# EAGLE design 3K_valdiklis_v1 (EAGLE 6.4)
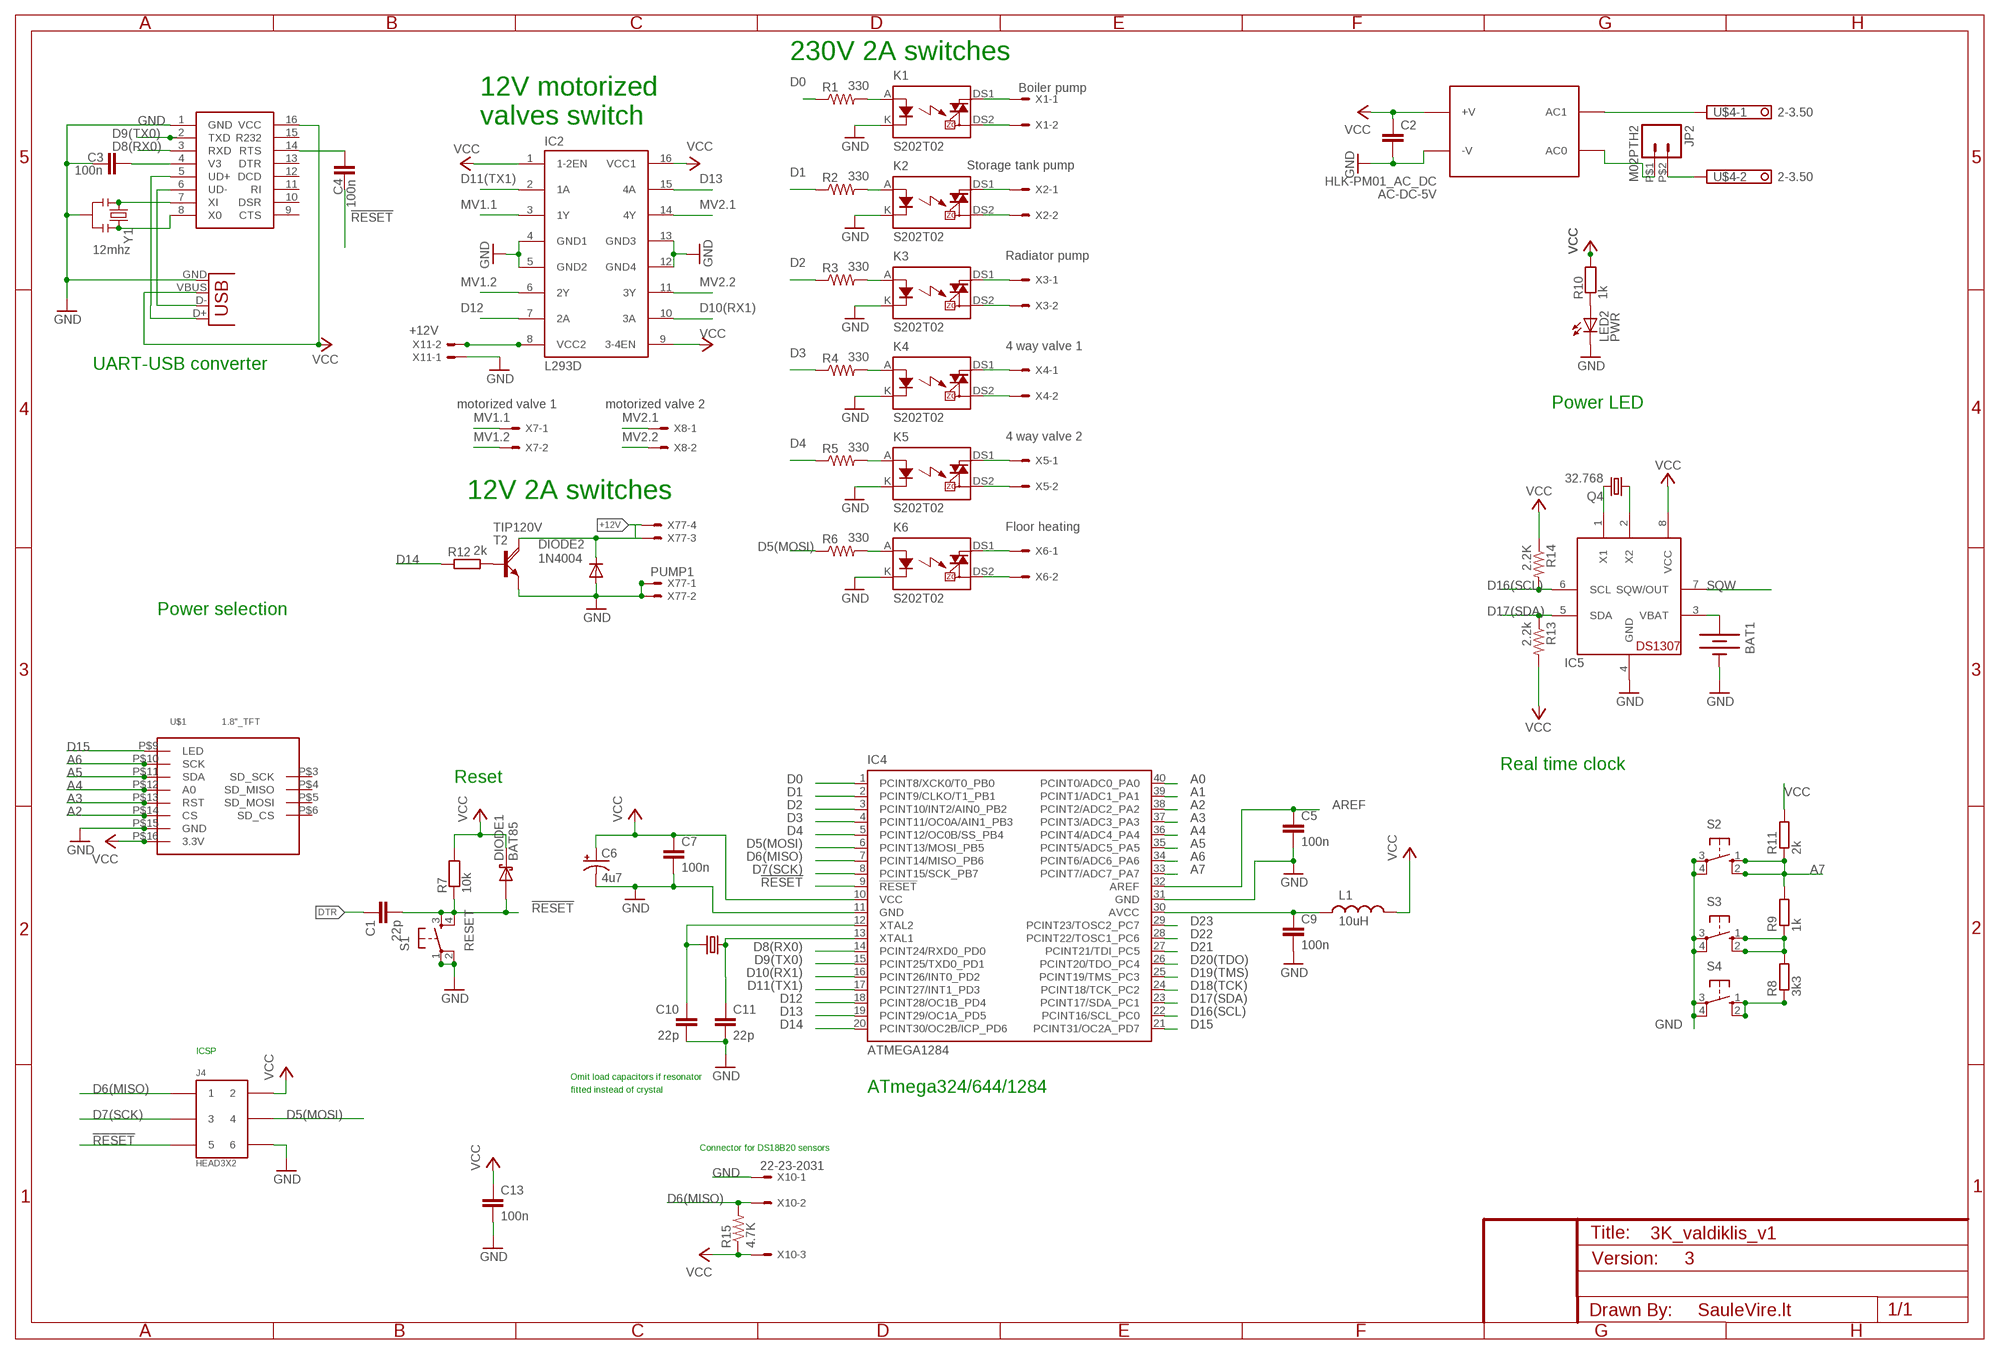
[diagram p0: schematic, sheet 1]

## Parts
AC-DC-5V  HLK-PM01_AC_DC  [HLK-PM01_AC_DC]
BAT1  BATTERY20PTH  [BATTCOM_20MM_PTH]
C1  22p  CAPPTH  [CAP-PTH-SMALL]
C2  C-EU025-024X044  [C025-024X044]
C3  100n  CAPPTH  [CAP-PTH-SMALL]
C4  100n  CAPPTH  [CAP-PTH-SMALL]
C5  100n  CAPPTH  [CAP-PTH-SMALL]
C6  4u7  CAP_POLPTH2  [CPOL-RADIAL-10UF-25V]
C7  100n  CAPPTH  [CAP-PTH-SMALL]
C9  100n  CAPPTH  [CAP-PTH-SMALL]
C10  22p  CAPPTH  [CAP-PTH-SMALL]
C11  22p  CAPPTH  [CAP-PTH-SMALL]
C13  100n  CAPPTH  [CAP-PTH-SMALL]
DIODE1  BAT85  DIODE-SCHOTTKY  [DIODE-TH-0.4]
DIODE2  1N4004  [DO41-10]
IC2  L293D  [DIL16]
IC4  ATMEGA1284  ATMEGA644-20PU  [DIL40]
IC5  DS1307  [DIL08]
J4  HEAD3X2  [HEAD3X2]
JP2  M02PTH2  [1X02_BIG]
JP3  USB-B  USBPTH  [USB-B-PTH]
K1  S202T02  [S202T02]
K2  S202T02  [S202T02]
K3  S202T02  [S202T02]
K4  S202T02  [S202T02]
K5  S202T02  [S202T02]
K6  S202T02  [S202T02]
L1  10uH  INDUCTOR0.4"-AXIAL  [RES-AXIAL-0.4]
LED2  PWR  LED3MM  [LED3MM]
Q4  32.768  CRYTALTC38H  [TC38H]
R1  330  R-US_0207/10  [0207/10]
R2  330  R-US_0207/10  [0207/10]
R3  330  R-US_0207/10  [0207/10]
R4  330  R-US_0207/10  [0207/10]
R5  330  R-US_0207/10  [0207/10]
R6  330  R-US_0207/10  [0207/10]
R7  10k  RESISTOR  [RES-AXIAL-0.4]
R8  3k3  R-EU_0207/10  [0207/10]
R9  1k  R-EU_0207/10  [0207/10]
R10  1k  RESISTOR  [RES-AXIAL-0.4]
R11  2k  R-EU_0207/10  [0207/10]
R12  2k  R-EU_0207/10  [0207/10]
R13  2.2k  R-US_0207/10  [0207/10]
R14  2.2K  R-US_0207/10  [0207/10]
R15  4.7K  R-US_0207/10  [0207/10]
S1  RESET  TAC_SWITCHPTH  [TACTILE-PTH]
S2  10-XX  [B3F-10XX]
S3  10-XX  [B3F-10XX]
S4  10-XX  [B3F-10XX]
T2  TIP120V  [TO220AV]
U$1  1.8"_TFT  [1.8"_TFT]
U$2  CH340G  [SO016]
U$4  2-3.50  [2-3.50]
X1  Boiler pump  22-23-2021  [22-23-2021]
X2  Storage tank pump  22-23-2021  [22-23-2021]
X3  Radiator pump  22-23-2021  [22-23-2021]
X4  4 way valve 1  22-23-2021  [22-23-2021]
X5  4 way valve 2  22-23-2021  [22-23-2021]
X6  Floor heating  22-23-2021  [22-23-2021]
X7  motorized valve 1  22-23-2021  [22-23-2021]
X8  motorized valve 2  22-23-2021  [22-23-2021]
X9  16MHz  CRYSTALHC49US  [HC49US]
X10  22-23-2031  [22-23-2031]
X11  +12V  22-23-2021  [22-23-2021]
X77  PUMP1  22-23-2041  [22-23-2041]
Y1  12mhz  RESONATORPTH  [RESONATOR-PTH]

## Nets
220V [220v]: AC-DC-5V.AC1 U$4.1
!RESET: C1.2 C4.1 DIODE1.A IC4.9(!RESET) J4.5 R7.P$1 S1.3 S1.4
+12V: DIODE2.C T2.C X77.3 X77.4
A0: IC4.40(PCINT0/ADC0_PA0)
A1: IC4.39(PCINT1/ADC1_PA1)
A2: IC4.38(PCINT2/ADC2_PA2) U$1.P$14(CS)
A3: IC4.37(PCINT3/ADC3_PA3) U$1.P$13(RST)
A4: IC4.36(PCINT4/ADC4_PA4) U$1.P$12(A0)
A5: IC4.35(PCINT5/ADC5_PA5) U$1.P$11(SDA)
A6: IC4.34(PCINT6/ADC6_PA6) U$1.P$10(SCK)
A7: IC4.33(PCINT7/ADC7_PA7) R9.2 R11.1 S2.1(S) S2.2(S1)
AREF: C5.1 IC4.32(AREF)
AVCC [vcc]: C9.1 IC4.30(AVCC) L1.P$1
D0: IC4.1(PCINT8/XCK0/T0_PB0) R1.1
D1: IC4.2(PCINT9/CLKO/T1_PB1) R2.1
D2: IC4.3(PCINT10/INT2/AIN0_PB2) R3.1
D3: IC4.4(PCINT11/OC0A/AIN1_PB3) R4.1
D4: IC4.5(PCINT12/OC0B/SS_PB4) R5.1
D5(MOSI): IC4.6(PCINT13/MOSI_PB5) J4.4 R6.1
D6(MISO): IC4.7(PCINT14/MISO_PB6) J4.1 R15.2 X10.2
D7(SCK): IC4.8(PCINT15/SCK_PB7) J4.3
D8(RX0): IC4.14(PCINT24/RXD0_PD0) U$2.3(RXD)
D9(TX0): IC4.15(PCINT25/TXD0_PD1) U$2.2(TXD)
D10(RX1): IC2.10(3A) IC4.16(PCINT26/INT0_PD2)
D11(TX1): IC2.2(1A) IC4.17(PCINT27/INT1_PD3)
D12: IC2.7(2A) IC4.18(PCINT28/OC1B_PD4)
D13: IC2.15(4A) IC4.19(PCINT29/OC1A_PD5)
D14: IC4.20(PCINT30/OC2B/ICP_PD6) R12.1
D15: IC4.21(PCINT31/OC2A_PD7) U$1.P$9(LED)
D16(SCL): IC4.22(PCINT16/SCL_PC0) IC5.6(SCL) R14.2
D17(SDA): IC4.23(PCINT17/SDA_PC1) IC5.5(SDA) R13.1
D18(TCK): IC4.24(PCINT18/TCK_PC2)
D19(TMS): IC4.25(PCINT19/TMS_PC3)
D20(TDO): IC4.26(PCINT20/TDO_PC4)
D21: IC4.27(PCINT21/TDI_PC5)
D22: IC4.28(PCINT22/TOSC1_PC6)
D23: IC4.29(PCINT23/TOSC2_PC7)
DTR: C1.1
GND [vcc]: AC-DC-5V.-V BAT1.2(-) C2.2 C3.1 C5.2 C6.2(-) C7.2 C9.2 C10.2 C11.2 C13.2 DIODE2.A IC2.4(GND1) IC2.5(GND2) IC2.12(GND4) IC2.13(GND3) IC4.11(GND) IC4.31(GND) IC5.4(GND) J4.6 JP3.GND K1.K K2.K K3.K K4.K K5.K K6.K LED2.K(C) S1.1 S1.2 S2.3(P) S2.4(P1) S3.3(P) S3.4(P1) S4.3(P) S4.4(P1) T2.E U$1.P$15(GND) U$2.1(GND) X10.1 X11.1 X77.1 X77.2 Y1.2
MV1.1: IC2.3(1Y) X7.1
MV1.2: IC2.6(2Y) X7.2
MV2.1: IC2.14(4Y) X8.1
MV2.2: IC2.11(3Y) X8.2
N$1: C11.1 IC4.13(XTAL1) X9.1
N$2: C10.1 IC4.12(XTAL2) X9.2
N$3 [220v]: AC-DC-5V.AC0 JP2.P$1
N$4 [220v]: JP2.P$2 U$4.2
N$6: R8.1 S4.1(S) S4.2(S1)
N$7: U$2.7(XI) Y1.1
N$8: LED2.A R10.P$1
N$9: U$2.8(X0) Y1.3
N$10: R8.2 R9.1 S3.1(S) S3.2(S1)
N$11: C4.2 U$2.14(RTS)
N$12: JP3.D- U$2.6(UD-)
N$13: R12.2 T2.B
N$14: C3.2 U$2.4(V3)
N$16: K3.A R3.2
N$18 [220v]: K3.DS1 X3.1
N$19: IC2.8(VCC2) X11.2
N$20: IC5.1(X1) Q4.2
N$21: IC5.2(X2) Q4.1
N$22: JP3.D+ U$2.5(UD+)
N$23 [220v]: K3.DS2 X3.2
N$24: K2.A R2.2
N$25 [220v]: K2.DS1 X2.1
N$26 [220v]: K2.DS2 X2.2
N$27: BAT1.1(+) IC5.3(VBAT)
N$28: K4.A R4.2
N$29 [220v]: K4.DS1 X4.1
N$30 [220v]: K4.DS2 X4.2
N$31: K1.A R1.2
N$32 [220v]: K1.DS1 X1.1
N$33 [220v]: K1.DS2 X1.2
N$34: K6.A R6.2
N$35 [220v]: K6.DS1 X6.1
N$36 [220v]: K6.DS2 X6.2
N$37: K5.A R5.2
N$38 [220v]: K5.DS1 X5.1
N$39 [220v]: K5.DS2 X5.2
SQW: IC5.7(SQW/OUT)
VCC [vcc]: AC-DC-5V.+V C2.1 C6.1(+) C7.1 C13.1 DIODE1.C IC2.1(1-2EN) IC2.9(3-4EN) IC2.16(VCC1) IC4.10(VCC) IC5.8(VCC) J4.2 JP3.VBUS L1.P$2 R7.P$2 R10.P$2 R11.2 R13.2 R14.1 R15.1 U$1.P$16(3.3V) U$2.16(VCC) X10.3
Unconnected: U$1.P$3(SD_SCK) U$1.P$4(SD_MISO) U$1.P$5(SD_MOSI) U$1.P$6(SD_CS) U$2.9(CTS) U$2.10(DSR) U$2.11(RI) U$2.12(DCD) U$2.13(DTR) U$2.15(R232)

## Notes on the sheet
- 230V 2A switches
- 12V motorized 
  valves switch
- UART-USB converter
- Power LED
- 12V 2A switches
- Power selection
- Real time clock
- Reset
- ICSP
- Omit load capacitors if resonator
- fitted instead of crystal | ATmega324/644/1284
- Connector for DS18B20 sensors
- 3
- SauleVire.lt

## Library data of the parts
AC-DC-5V = HLK-PM01:HLK-PM01_AC_DC: Ultra-compact power module HLK-PM01, http://www.hlktech.net AC-DC 220V to 5V Step Down Power Supply Module Device model created 2016-01-23 by Alvydas. http://www.saulevire.lt
BAT1 = SparkFun-Electromechanical:BATTERY: Battery Holders Various common sizes : AA, AAA, 20mm coin cell and 12mm coin cell. 20MM_4LEGS, BATT-10373
C1 C10 C11 = SparkFun:CAP: Capacitor Standard 0603 ceramic capacitor, and 0.1" leaded capacitor.; OPTION: Do not fit for ceramic resonator
C2 = rcl-1:C-EU: CAPACITOR, European symbol
C3-C5 C7 C9 C13 = SparkFun:CAP: Capacitor Standard 0603 ceramic capacitor, and 0.1" leaded capacitor.
C6 = SparkFun:CAP_POL: Capacitor Polarized These are standard SMD and PTH capacitors. Normally 10uF, 47uF, and 100uF in electrolytic and tantalum varieties. Always verify the external diameter of the through hole cap, it varies with capacity, voltage, and manufacturer. The EIA devices should be standard.
DIODE1 = SteveMarple:DIODE-SCHOTTKY
DIODE2 = diode:1N4004: DIODE general purpose rectifier, 1 A
IC2 = st-microelectronics:L293D: PUSH-PULL 4 CHANNEL DRIVER; MPN: L293D; OC_FARNELL: 9589619; OC_NEWARK: 56P8249
IC4 = SteveMarple:ATMEGA644-*PU: 8-bit Microcontroller with 64K Bytes In-System Programmable Flash Auto generated by make-symbol-device-package-bsdl.ulp Rev. 34 Source: http://www.atmel.com/dyn/resources/prod_documents/doc2593.pdf; MPN: ATMEGA644-20PU; OC_FARNELL: 1288340; OC_NEWARK: 23M5060
IC5 = adafruit:DS1307: DS1307 Real time clock (RTC) with battery backup ability. Talk to it via i2c
J4 = MyCON2:HEAD3X2
JP2 = SparkFun-Connectors-1:M02: Standard 2-pin 0.1" header. Use with - straight break away headers ( PRT-00116) - right angle break away headers (PRT-00553) - swiss pins (PRT-00743) - machine pins (PRT-00117) - female headers (PRT-00115) Molex polarized connector foot print use with: PRT-08233 with associated crimp pins and housings. 2.54_SCREWTERM for use with PRT-10571. 3.5mm Screw Terminal footprints for PRT-08084 5mm Screw Terminal footprints for use with PRT-08433
JP3 = SparkFun-Connectors-1:USB: USB Connectors USB-B-PTH is fully proven SKU : PRT-00139/CONN-08278 USB-miniB is fully proven SKU : PRT-00587 USB-A-PCB is untested. USB-A-H is throughly reviewed, but untested. Spark Fun Electronics SKU : PRT-00437 USB-B-SMT is throughly reviewed, but untested. Needs silkscreen touching up. USB-A-S has not been used/tested USB-MB-H has not been used/tested USB-MICROB has been used. CONN-09505; PROD_ID: CONN-08278
K1-K6 = relay-1:S202T02
L1 = SteveMarple:INDUCTOR: Inductors Basic Inductor/Choke - 0603 and 1206. Footprints are not proven and vary greatly between part numbers.
LED2 = SparkFun:LED: LEDs Standard schematic elements and footprints for 5mm, 3mm, 1206, and 0603 sized LEDs. 5mm - Spark Fun Electronics SKU : COM-00529 (and others)
Q4 = crystal:CRYTAL: CRYSTAL
R1-R6 = resistor-1:R-US_: RESISTOR, American symbol
R7 R10 = SteveMarple:RESISTOR: 1/4W PTH resistor
R8 R9 R11 R12 = resistor:R-EU_: RESISTOR, European symbol
R13-R15 = adafruit:R-US_: RESISTOR, American symbol
S1 = SparkFun:TAC_SWITCH: Momentary Switch Button commonly used for reset or general input. Spark Fun Electronics SKU : COM-00097
S2-S4 = switch-omron:10-XX: OMRON SWITCH; MPN: B3F-1000; OC_FARNELL: 176432; OC_NEWARK: 36M3542
T2 = rocketfarm:TIP120: NPN DARLINGTON TRANSISTOR
U$1 = tft_1.8_1.44_oled_0.96:1.8"_TFT
U$2 = ch340:CH340G: CH340G
U$4 = con-phoenix-350-1:2-3.50
X1-X8 X11 = con-molex:22-23-2021: .100" (2.54mm) Center Header - 2 Pin; MF: MOLEX; MPN: 22-23-2021; OC_FARNELL: 1462926; OC_NEWARK: 25C3832
X9 = SparkFun:CRYSTAL: Crystals Various standard crystals. Proven footprints. Spark Fun Electronics SKU : COM-00534
X10 = con-molex:22-23-2031: .100" (2.54mm) Center Header - 3 Pin; MF: MOLEX; MPN: 22-23-2031; OC_FARNELL: 1462950; OC_NEWARK: 30C0862
X77 = con-molex:22-23-2041: .100" (2.54mm) Center Header - 4 Pin; MF: MOLEX; MPN: 22-23-2041; OC_FARNELL: 1462920; OC_NEWARK: 38C0355
Y1 = SparkFun-FreqCtrl:RESONATOR: Resonator Small SMD resonator. Used, eg, on the Arduino Pro/ Pro Mini boards. 8MHz- XTAL-08895 16MHz- XTAL-08900

## Net classes
1 vcc: width 0.5 mm
4 gnd: width 0.5 mm
5 220v: width 0.5 mm

## Board
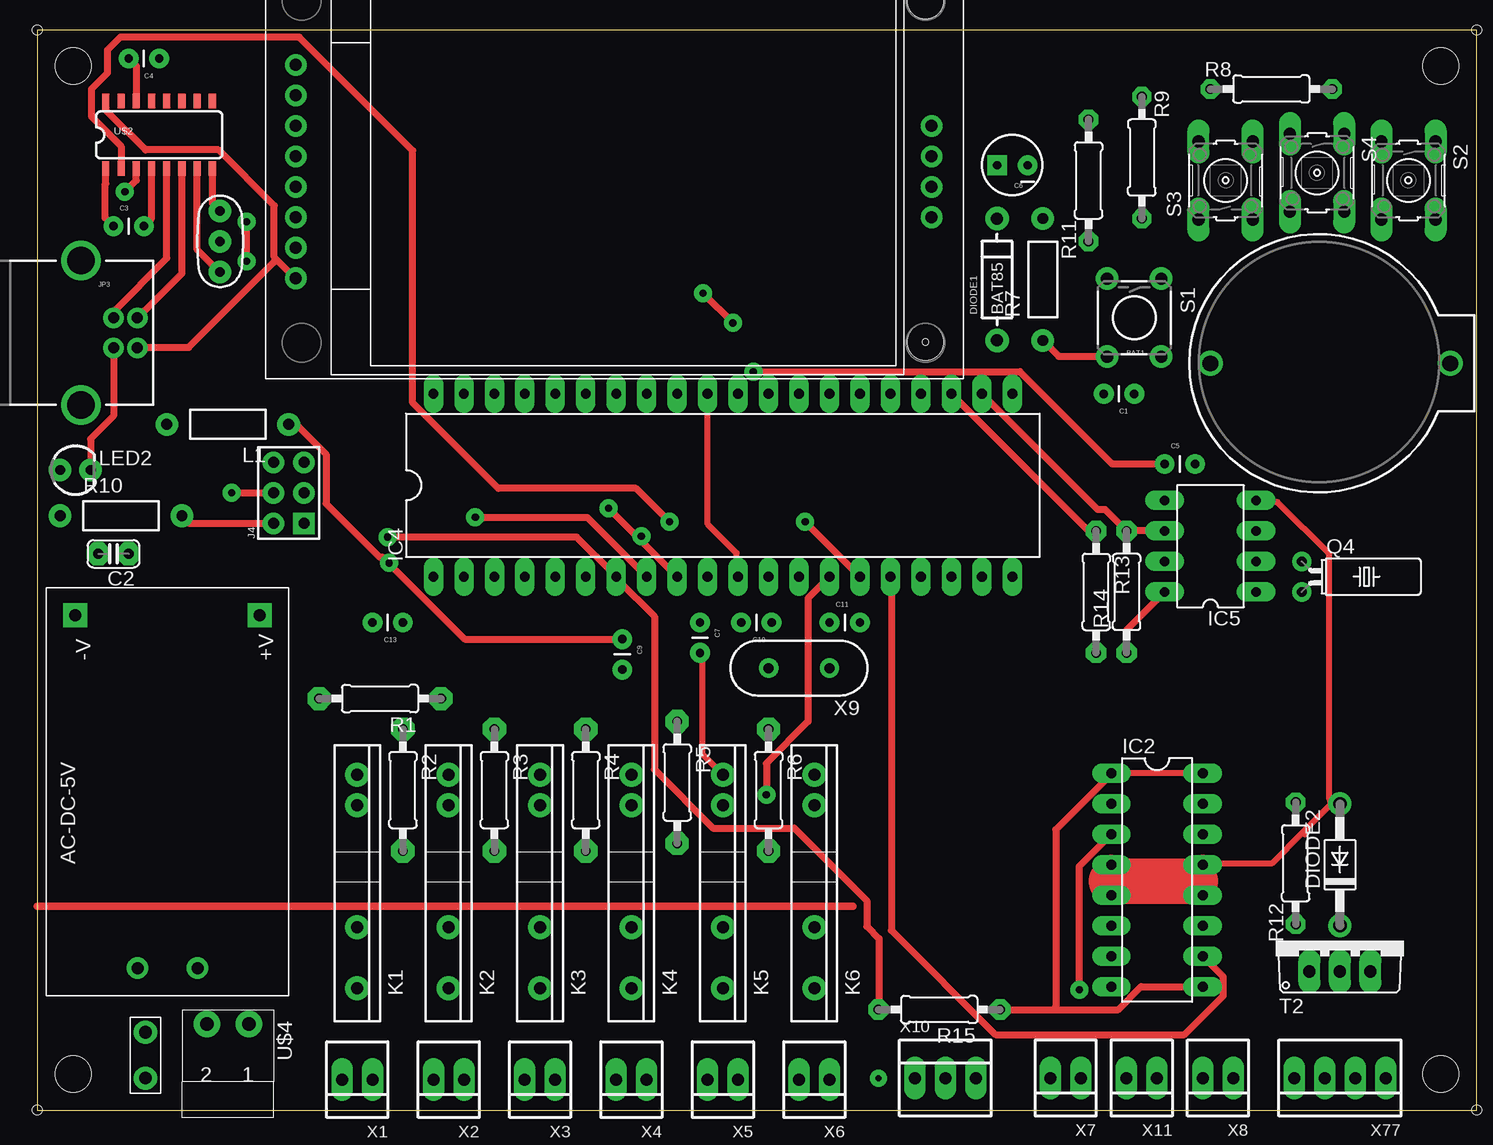
[diagram p1: board, top side]
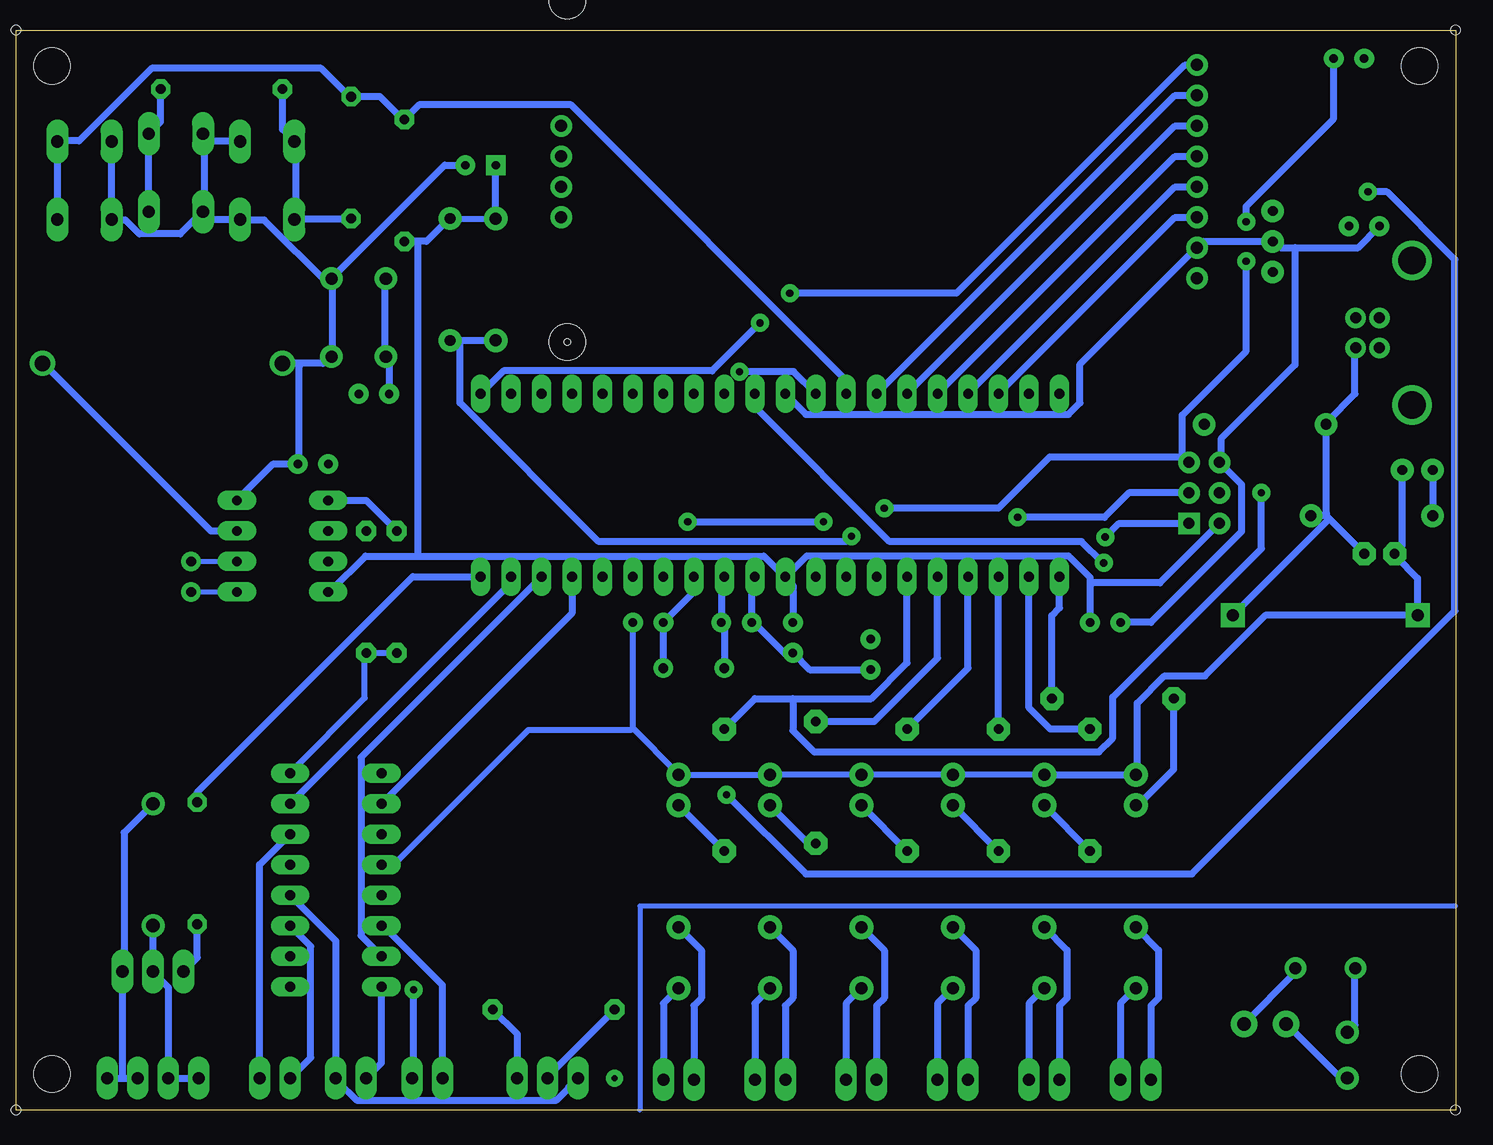
[diagram p2: board, bottom side, seen from below]

No outline drawn. Coordinates in mm, seen from the top.
Copper layers (1*16): Top 0.035mm / dielectric 1.5mm / Bottom 0.035mm
Design rules "3K_valdiklis_v1 *": minimum track width 0.6mm, minimum drill 0.6mm, track to track 0.6mm, track to pad 0.6mm, pad to pad 0.6mm, via to via 0.6mm, smd to smd 0.6mm, copper to edge 0.6mm, drill to drill 0.6mm, minimum pad ring 0.4mm, minimum via ring 0.45mm, stop-mask expansion 0.6mm, vias tented up to drill 0.6mm, thermal gap 0.6mm
Holes 0.51 mm at 74.04,64.01
Holes 3 mm at 74.04,64.01 74.04,92.46 3,87 117,87 3,3 117,3
Holes 0.8 mm at 0,0 0,90 120,90 120,0
Milling: 4 lines

### Footprints (pad centres in the part's own frame; a part is rotated, then mirrored left to right if it is on the bottom)
HLK-PM01_AC_DC = drill 1 pad 2 square: +V 31.7,2.4; -V 31.7,17.8 | drill 1: AC0 2.3,12.6; AC1 2.3,7.6
BATTCOM_20MM_PTH = drill 1.3: 1 20,0; 2 0,0
CAP-PTH-SMALL = drill 0.7 pad 1.651: 1 0,0; 2 2.54,0
C025-024X044 = drill 0.813 pad 1.93 octagon: 1 -1.27,0; 2 1.27,0
CPOL-RADIAL-10UF-25V = drill 0.7 pad 1.651 square: 1 1.27,0 | drill 0.7 pad 1.651: 2 -1.27,0
DIODE-TH-0.4 = drill 1 pad 1.981: A -5.08,0; C 5.08,0
DO41-10 = drill 1.118: A 5.08,0; C -5.08,0
DIL16 = drill 0.813 long: 1 -8.89,-3.81; 2 -6.35,-3.81; 3 -3.81,-3.81; 4 -1.27,-3.81; 5 1.27,-3.81; 6 3.81,-3.81; 7 6.35,-3.81; 8 8.89,-3.81; 9 8.89,3.81; 10 6.35,3.81; 11 3.81,3.81; 12 1.27,3.81; 13 -1.27,3.81; 14 -3.81,3.81; 15 -6.35,3.81; 16 -8.89,3.81
DIL40 = drill 0.813 long: 1 -24.13,-7.62; 2 -21.59,-7.62; 3 -19.05,-7.62; 4 -16.51,-7.62; 5 -13.97,-7.62; 6 -11.43,-7.62; 7 -8.89,-7.62; 8 -6.35,-7.62; 9 -3.81,-7.62; 10 -1.27,-7.62; 11 1.27,-7.62; 12 3.81,-7.62; 13 6.35,-7.62; 14 8.89,-7.62; 15 11.43,-7.62; 16 13.97,-7.62; 17 16.51,-7.62; 18 19.05,-7.62; 19 21.59,-7.62; 20 24.13,-7.62; 21 24.13,7.62; 22 21.59,7.62; 23 19.05,7.62; 24 16.51,7.62; 25 13.97,7.62; 26 11.43,7.62; 27 8.89,7.62; 28 6.35,7.62; 29 3.81,7.62; 30 1.27,7.62; 31 -1.27,7.62; 32 -3.81,7.62; 33 -6.35,7.62; 34 -8.89,7.62; 35 -11.43,7.62; 36 -13.97,7.62; 37 -16.51,7.62; 38 -19.05,7.62; 39 -21.59,7.62; 40 -24.13,7.62
DIL08 = drill 0.813 long: 1 -3.81,-3.81; 2 -1.27,-3.81; 3 1.27,-3.81; 4 3.81,-3.81; 5 3.81,3.81; 6 1.27,3.81; 7 -1.27,3.81; 8 -3.81,3.81
HEAD3X2 = drill 0.914 pad 1.778 square: 1 0,0 | drill 0.914 pad 1.778: 2 0,2.54; 3 2.54,0; 4 2.54,2.54; 5 5.08,0; 6 5.08,2.54
1X02_BIG = drill 1.067 pad 1.93: P$1 0,0; P$2 3.81,0
USB-B-PTH = drill 0.914 pad 1.676: D+ 0,1.25; D- 1.981,1.25; GND 0,-1.25; VBUS 1.981,-1.25 | drill 2.286: S1 -2.718,-6.02; S2 -2.718,6.02
S202T02 = drill 1 pad 2: A 10.16,0; DS1 -5.08,0; DS2 0,0; K 12.7,0
RES-AXIAL-0.4 = drill 0.9 pad 1.88: P$1 -5.08,0; P$2 5.08,0
LED3MM = drill 0.813 pad 1.88: A -1.27,0; K 1.27,0
TC38H = drill 0.813: 1 -1.27,0; 2 1.27,0
0207/10 = drill 0.813 pad 1.93 octagon: 1 -5.08,0; 2 5.08,0
0207/10' = drill 0.813 octagon: 1 -5.08,0; 2 5.08,0
0207/10'' = drill 0.813 pad 1.676 octagon: 1 -5.08,0; 2 5.08,0
TACTILE-PTH = drill 1.016 pad 1.88: 1 -3.251,2.261; 2 3.251,2.261; 3 -3.251,-2.261; 4 3.251,-2.261
B3F-10XX = drill 1.016 long: 1 -3.251,2.261; 2 3.251,2.261; 3 -3.251,-2.261; 4 3.251,-2.261
TO220AV = drill 1.016 long: B -2.54,-2.54; C 0,-2.54; E 2.54,-2.54
1.8"_TFT = drill 1 pad 1.778: P$3 55.5,21.05; P$4 55.5,18.52; P$5 55.5,15.98; P$6 55.5,13.44; P$9 2.5,26.14; P$10 2.5,23.6; P$11 2.5,21.06; P$12 2.5,18.52; P$13 2.5,15.98; P$14 2.5,13.44; P$15 2.5,10.9; P$16 2.5,8.36
SO016 = smd 0.6 x 1.2: 1 -4.445,-2.8; 2 -3.175,-2.8; 3 -1.905,-2.8; 4 -0.635,-2.8; 5 0.635,-2.8; 6 1.905,-2.8; 7 3.175,-2.8; 8 4.445,-2.8; 9 4.445,2.8; 10 3.175,2.8; 11 1.905,2.8; 12 0.635,2.8; 13 -0.635,2.8; 14 -1.905,2.8; 15 -3.175,2.8; 16 -4.445,2.8
2-3.50 = drill 1.1 pad 2.184: 1 2.05,1.2; 2 5.55,1.2
22-23-2021 = drill 1 long: 1 -1.27,0; 2 1.27,0
HC49US = drill 0.813: 1 -2.54,0; 2 2.54,0
22-23-2031 = drill 1 long: 1 -2.54,0; 2 0,0; 3 2.54,0
22-23-2041 = drill 1 long: 1 -3.81,0; 2 -1.27,0; 3 1.27,0; 4 3.81,0
RESONATOR-PTH = drill 0.8 pad 1.88: 1 -2.54,0; 2 0,0; 3 2.54,0

### Placement (x,y rotation side)
AC-DC-5V  20.95,9.53 90 top
BAT1  97.79,62.23 0 top
C1  91.44,59.69 180 top
C2  6.35,46.35 180 top
C3  6.35,73.66 0 top
C4  10.16,87.63 180 top
C5  93.98,53.85 0 top
C6  81.28,78.74 180 top
C7  55.24,40.64 270 top
C9  48.77,39.24 270 top
C10  61.21,40.64 180 top
C11  66.04,40.64 0 top
C13  30.48,40.64 180 top
DIODE1  80.01,69.22 90 top
DIODE2  108.58,20.45 90 top
IC2  93.34,19.18 270 top
IC4  57.15,52.07 0 top
IC5  97.79,46.99 90 top
J4  22.23,48.9 90 top
JP2  9.02,6.48 270 top
JP3  6.35,64.77 0 top
K1  26.67,15.24 90 top
K2  34.29,15.24 90 top
K3  41.91,15.24 90 top
K4  49.53,15.24 90 top
K5  57.15,15.24 90 top
K6  64.77,15.24 90 top
L1  15.88,57.15 180 top
LED2  3.17,53.34 0 top
Q4  105.41,44.45 270 top
R1  28.57,34.29 180 top
R2  30.48,26.67 270 top
R3  38.1,26.67 270 top
R4  45.72,26.67 270 top
R5  53.34,27.3 270 top
R6  60.96,26.67 270 top
R7  83.82,69.22 90 top
R8  3k3  [0207/10']  102.87,85.09 180 top
R9  1k  [0207/10']  92.08,79.38 90 top
R10  6.99,49.53 0 top
R11  2k  [0207/10']  87.63,77.47 270 top
R12  2k  [0207/10']  104.9,20.57 270 top
R13  2.2k  [0207/10'']  88.27,43.18 270 top
R14  2.2K  [0207/10'']  90.81,43.18 90 top
R15  4.7K  [0207/10'']  75.18,8.38 180 top
S1  91.44,66.04 270 top
S2  114.3,77.47 270 top
S3  99.06,77.47 90 top
S4  106.68,78.11 270 top
T2  108.58,14.1 0 top
U$1  19.05,60.96 0 top
U$2  10.16,81.28 0 top
U$4  19.68,8.38 180 top
X1  26.67,2.54 180 top
X2  34.29,2.54 180 top
X3  41.91,2.54 180 top
X4  49.53,2.54 180 top
X5  57.15,2.54 180 top
X6  64.77,2.54 180 top
X7  85.72,2.67 180 top
X8  98.42,2.67 180 top
X9  63.5,36.83 180 top
X10  75.69,2.67 0 top
X11  92.08,2.67 180 top
X77  108.58,2.67 180 top
Y1  15.24,72.39 90 top

### Tracks (layer width: path | path; a pad name or v marks a point on that pad's centre or on a via)
220V
  Bottom 0.6: AC-DC-5V.AC1 13.4,11.81 13.4,11.43 17.59,7.24 U$4.1
!RESET  (via drill 0.6)
  Top 0.6: R7.P$1 85.15,62.8 89.15,62.8 S1.4 | v17.46,70.74 v17.46,74.04 | v47.62,50.16 50.16,47.62 | 50.16,47.62 IC4.9 | v50.35,47.82 50.16,47.62
  Bottom 0.6: DIODE1.A 83.57,64.14 R7.P$1 83,63.88 83,58.93 71.44,47.37 50.8,47.37 v50.35,47.82 | S1.3 89.22,69.28 89.22,63.06 S1.4 88.9,62.67 C1.2 | C4.1 10.16,82.61 17.46,75.31 v17.46,74.04 | v17.46,70.74 17.46,63.25 22.8,57.91 22.8,54.55 | J4.5 22.8,54.55 | v47.62,50.16 38.1,50.16 33.85,54.42 23.05,54.42 22.8,54.55
+12V
  Bottom 0.6: DIODE2.C 108.58,11.81 T2.C 108.58,11.49 107.31,10.22 X77.3 107.06,2.67 X77.4
A2
  Bottom 0.6: IC4.38 23.43,74.36 21.59,74.36 U$1.P$14
A3
  Bottom 0.6: IC4.37 23.43,76.9 21.59,76.9 U$1.P$13
A4
  Bottom 0.6: IC4.36 23.43,79.44 21.59,79.44 U$1.P$12
A5
  Bottom 0.6: IC4.35 23.43,81.98 21.59,81.98 U$1.P$11
A6
  Bottom 0.6: IC4.34 23.43,84.52 21.59,84.52 U$1.P$10
A7
  Bottom 0.6: S2.2 116.59,74.23 116.59,80.71 S2.1 116.27,80.77 114.75,80.77 108.71,86.81 94.55,86.81 92.33,84.58 R9.2 89.66,84.45 87.88,82.68 R11.1 86.36,83.82 73.79,83.82 50.8,60.83 IC4.33
AREF  (via drill 0.6)
  Top 0.6: C5.1 89.6,53.85 81.92,61.53 v59.69,61.53
  Bottom 0.6: v59.69,61.53 55.18,61.53 IC4.32
AVCC  (via drill 0.6)
  Top 0.6: C9.1 35.62,39.24 29.3,45.56 | 29.3,45.56 28.77,46.1 28.51,46.1 24.07,50.55 24.07,54.67 21.59,57.15 L1.P$1 | v29.34,45.59 29.3,45.56
  Bottom 0.6: IC4.30 58.42,58.61 47.18,47.37 31.18,47.37 29.4,45.59 v29.34,45.59
D0
  Bottom 0.6: IC4.1 33.02,41.85 33.66,41.21 R1.1
D1
  Bottom 0.6: IC4.2 35.56,33.53 33.78,31.75 R2.1
D2
  Bottom 0.6: R3.1 IC4.3
D3
  Bottom 0.6: IC4.4 40.64,36.83 R4.1
D4
  Bottom 0.6: IC4.5 43.18,37.66 48.45,32.38 R5.1
D5(MOSI)  (via drill 0.6)
  Top 0.6: v16.19,51.44 J4.4
  Bottom 0.6: IC4.6 45.72,37.27 48.7,34.29 55.24,34.29 | 55.24,34.29 58.42,34.29 R6.1 | v16.19,51.44 16.19,46.8 28.57,34.42 28.57,30.99 29.72,29.84 53.47,29.84 55.24,31.62 55.24,34.04 55.24,34.29
D6(MISO)  (via drill 0.6)
  Top 0.4: 70.23,8.57 R15.2
  Top 0.6: R15.2 70.17,8.76 70.17,14.29 69.15,15.3 69.15,17.46 63.12,23.5 56.33,23.5 51.44,28.38 51.44,41.15 48.39,44.2 IC4.7 48.07,44.64 44.96,47.75 v29.21,47.75
  Bottom 0.6: X10.2 75.69,2.79 R15.2 | J4.1 28.07,48.9 v29.21,47.75
D7(SCK)  (via drill 0.6)
  Top 0.6: IC4.8 45.85,49.4 v36.51,49.4
  Bottom 0.6: v36.51,49.4 29.27,49.4 27.24,51.44 J4.3
D8(RX0)  (via drill 0.6)
  Top 0.6: v7.3,76.52 8.26,77.47 8.26,78.42 U$2.3 | v60.77,26.29 60.77,28.89 64.26,32.38 64.26,42.67 IC4.14
  Bottom 0.6: v7.3,76.52 5.71,76.52 0.06,70.87 0.06,41.59 21.97,19.68 54.17,19.68 v60.77,26.29
D9(TX0)  (via drill 0.6)
  Top 0.6: v52.7,49.02 49.91,51.82 38.42,51.82 31.3,58.93 31.3,79.95 21.84,89.41 6.92,89.41 5.84,88.33 5.84,86.42 4.51,85.09 4.51,82.8 6.99,80.33 U$2.2 | IC4.15 v64.01,49.02
  Bottom 0.6: v64.01,49.02 v52.7,49.02
D10(RX1)
  Top 0.6: IC2.10 98.87,11.11 98.87,9.53 95.63,6.29 79.88,6.29 71.18,14.99 71.18,44.39 IC4.16
D11(TX1)
  Bottom 0.6: IC2.2 73.66,41.4 IC4.17
D12
  Bottom 0.6: IC2.7 91.25,14.54 91.25,29.4 IC4.18
D13
  Bottom 0.6: IC2.15 78.74,43.94 IC4.19
D14
  Bottom 0.6: IC4.20 86.93,44.45 104.9,26.48 R12.1
D15  (via drill 0.6)
  Top 0.6: v55.5,68.07 v57.98,65.6
  Bottom 0.6: IC4.21 79.38,61.59 61.98,61.59 v57.98,65.6 | v55.5,68.07 41.59,68.07 22.61,87.06 21.59,87.06 U$1.P$9
D16(SCL)
  Top 0.6: IC5.6 R14.2 90.61,48.45 89.03,50.04 88.39,50.04 IC4.22
D17(SDA)
  Top 0.6: IC4.23 87.63,48.26 R13.1
  Bottom 0.6: R13.1 90.81,50.8 IC5.5
GND
  Top 0.5: DIODE2.A 107.89,25.53 105.5,23.15 | 105.5,23.15 102.93,20.57 97.35,20.57 IC2.13 | 105.66,22.99 105.5,23.15 | IC4.31 55.88,48.83 58.29,46.42 58.29,44.64 IC4.11 | K5.K 55.44,29.65 55.44,37.72 C7.2 | 107.76,25.72 DIODE2.A | DIODE2.A 107.7,25.97 107.7,46.35 103.38,50.67 101.79,50.67 IC5.4 101.6,51.05
  Top 0.6: LED2.K 4.45,55.94 6.35,57.85 6.35,63.5 JP3.GND | C3.1 5.65,74.36 5.65,77.15 5.71,77.22 5.71,78.42 U$2.1
  Top 1.676: IC2.4 89.53,19.05 IC2.5 | IC2.13 96.52,19.05 IC2.12
  Top 3.81: 89.53,19.05 96.52,19.05
  Bottom 0.5: K2.K 34.48,27.94 K3.K 42.1,27.94 K4.K 49.72,27.94 56.96,27.94 K5.K 57.34,27.94 64.58,27.94 K6.K 64.9,28.13 68.58,31.81 | 54.99,38.1 C7.2 | 68.58,31.81 C11.2 | IC2.4 88.52,20.45 77.28,31.69 68.77,31.69 68.58,31.81
  Bottom 0.6: IC2.12 93.34,14.1 X11.1 93.22,2.41 91.63,0.83 74.93,0.83 73.98,1.78 73.98,1.84 X10.1 | IC4.11 58.67,44.45 C10.2 58.42,40.51 55.63,37.72 C7.2 53.85,36.7 C9.2 | X77.1 111.12,2.67 | 111.12,2.67 X77.2 | 111.12,2.67 111.12,2.92 T2.E 111,11.81 111,23.11 DIODE2.A | C6.2 84.26,78.74 93.66,69.34 S1.1 | S1.1 93.66,69.03 93.66,63.06 S1.2 93.98,62.67 94.42,62.23 96.39,62.23 | LED2.K 4.45,46.99 C2.2 4.95,46.1 3.17,44.32 3.17,41.27 AC-DC-5V.-V 3.49,41.27 15.81,41.27 20.89,36.2 24.26,36.2 26.54,33.91 26.54,28.19 K1.K 34.1,27.94 K2.K | S2.3 112.08,80.71 112.08,74.23 S2.4 111.76,74.17 110.87,74.17 109.73,73.03 106.3,73.03 104.65,74.68 S4.4 | S4.4 104.39,74.8 103.82,74.23 101.35,74.23 S3.3 101.03,74.17 99.31,74.17 93.92,68.77 S1.1 | S3.4 101.35,80.77 103.82,80.77 104.39,81.34 S4.3 104.33,80.9 104.33,75.12 S4.4 | 96.39,62.23 BAT1.2 | IC5.4 98.55,53.85 C5.2 96.39,54.1 96.39,61.98 96.39,62.23 | IC4.31 54.17,57.98 32.26,57.98 31.3,58.93 31.3,62.17 21.78,71.69 U$1.P$15 21.53,71.88 21.02,72.39 Y1.2 14.99,72.26 14.61,71.88 13.4,71.88 | C3.1 8.13,71.88 13.4,71.88 | C13.2 25.4,40.64 17.84,48.2 17.84,52.13 J4.6 19.56,54.23 19.56,55.94 13.4,62.1 13.4,71.63 13.4,71.88
MV1.1  (via drill 0.6)
  Top 0.6: IC2.3 86.87,20.32 v86.87,10.03
  Bottom 0.6: v86.87,10.03 86.87,2.79 X7.1
MV1.2
  Bottom 0.6: IC2.6 89.41,15.37 84.45,10.41 X7.2
MV2.1
  Bottom 0.6: IC2.14 99.69,20.45 X8.1
MV2.2
  Bottom 0.6: IC2.11 95.44,13.65 95.44,4.38 X8.2
N$1
  Bottom 0.6: X9.1 C11.1 63.5,43.18 IC4.13
N$2
  Bottom 0.6: IC4.12 61.21,44.2 C10.1 60.96,40.51 X9.2
N$3
  Bottom 0.6: JP2.P$1 8.38,7.11 8.38,11.81 AC-DC-5V.AC0
N$4
  Bottom 0.6: JP2.P$2 9.59,2.67 14.1,7.18 U$4.2
N$5  (via drill 0.51)
  other vias: 70.1,2.67
N$6
  Bottom 0.6: R8.1 107.95,82.36 108.9,81.41 S4.1 108.97,81.09 108.97,74.87 S4.2
N$7
  Top 0.6: Y1.1 15.18,69.85 13.34,71.69 13.34,78.42 U$2.7
N$8
  Bottom 0.6: LED2.A R10.P$1
N$9
  Top 0.6: Y1.3 14.61,75.56 14.61,78.42 U$2.8
N$10
  Bottom 0.6: R9.1 96.71,74.3 96.77,74.23 S3.1 96.71,74.55 96.71,80.45 S3.2 96.84,80.77 97.79,81.72 R8.2
N$11
  Top 0.6: C4.2 8.26,87 8.26,84.14 U$2.14
N$12
  Top 0.6: U$2.6 12.06,78.42 12.06,69.72 8.38,66.04 JP3.D-
N$13
  Bottom 0.6: R12.2 104.9,12.7 T2.B
N$14
  Top 0.6: C3.2 9.53,74.3 9.53,78.42 U$2.4
N$15
  Top 0.61: 0,17 68,17
N$16
  Bottom 0.6: K3.A R3.2
N$18
  Bottom 0.6: X3.1 43.18,8.89 K3.DS1
N$19
  Bottom 0.6: IC2.8 89.53,3.94 X11.2
N$20
  Bottom 0.4: Q4.2 IC5.1
N$21
  Bottom 0.4: Q4.1 IC5.2
N$22
  Top 0.6: U$2.5 10.79,78.42 10.79,70.99 6.35,66.55 6.35,66.04 JP3.D+
N$23
  Bottom 0.6: X3.2 40.64,8.7 40.01,9.34 40.01,13.34 K3.DS2
N$24
  Bottom 0.6: K2.A R2.2
N$25
  Bottom 0.6: X2.1 35.56,8.89 K2.DS1
N$26
  Bottom 0.6: X2.2 33.02,8.7 32.38,9.34 32.38,13.34 K2.DS2
N$27
  Bottom 0.6: IC5.3 103.76,48.26 117.73,62.23 BAT1.1
N$28
  Bottom 0.6: K4.A R4.2
N$29
  Bottom 0.6: X4.1 50.8,8.89 K4.DS1
N$30
  Bottom 0.6: X4.2 48.26,8.7 47.62,9.34 47.62,13.34 K4.DS2
N$31
  Bottom 0.6: R1.2 23.5,28.38 26.48,25.4 K1.A
N$32
  Bottom 0.6: X1.1 27.94,8.89 K1.DS1
N$33
  Bottom 0.6: X1.2 25.4,8.7 24.77,9.34 24.77,13.34 K1.DS2
N$34
  Bottom 0.6: K6.A R6.2
N$35
  Bottom 0.6: X6.1 66.04,8.89 K6.DS1
N$36
  Bottom 0.6: X6.2 63.5,8.7 62.87,9.34 62.87,13.34 K6.DS2
N$37
  Bottom 0.6: R5.2 53.98,22.23 K5.A
N$38
  Bottom 0.6: X5.1 58.42,8.89 K5.DS1
N$39
  Bottom 0.6: X5.2 55.88,8.7 55.24,9.34 55.24,13.34 K5.DS2
VCC
  Top 0.5: IC2.16 IC2.1
  Top 0.6: R14.1 90.81,40.01 IC5.8 | IC2.9 92.01,10.29 90.11,8.38 84.9,8.38 | R15.1 84.9,8.38 | 84.9,8.38 84.9,8.64 84.9,23.37 89.41,27.88 IC2.1 | J4.2 12.7,48.9 R10.P$2 | 19.94,70.87 21.53,69.28 U$1.P$16 | 19.94,70.87 19.75,71.06 19.75,75.37 15.11,80.01 9.02,80.01 5.71,83.31 U$2.16 | 19.94,70.87 19.75,70.67 12.64,63.56 8.38,63.56 JP3.VBUS
  Bottom 0.5: DIODE1.C 83.63,74.3 R7.P$2 | R13.2 R14.1 90.93,37.91 90.93,34.35 97.03,28.26 IC2.16
  Bottom 0.6: C7.1 55.24,43.75 55.75,44.26 IC4.10 | IC4.10 55.69,44.7 55.56,44.7 54.1,46.16 32.26,46.16 32.07,45.97 30.48,44.39 30.48,43.94 | 86.49,46.16 90.87,46.16 93.73,43.31 IC5.8 | 86.49,46.16 57.66,46.16 56.13,44.64 IC4.10 | X10.3 78.23,6.35 R15.1 | C6.1 80.01,74.49 DIODE1.C | 86.49,72.39 85.79,72.39 84.01,74.17 R7.P$2 | 86.49,72.39 R11.2 | 86.49,72.39 86.49,72.14 86.49,46.42 86.49,46.16 | 10.79,49.53 R10.P$2 | C2.1 10.54,49.28 | 10.54,49.28 10.79,49.53 | 10.79,49.53 10.79,49.78 L1.P$2 10.67,57.4 8.38,59.69 8.38,63.5 JP3.VBUS | AC-DC-5V.+V 18.54,41.27 10.73,49.09 10.54,49.28 | 30.48,43.94 C13.1 | J4.2 24.64,43.94 30.23,43.94 30.48,43.94
XBOT
  Bottom 0.406: 0,17 68,17 68,0